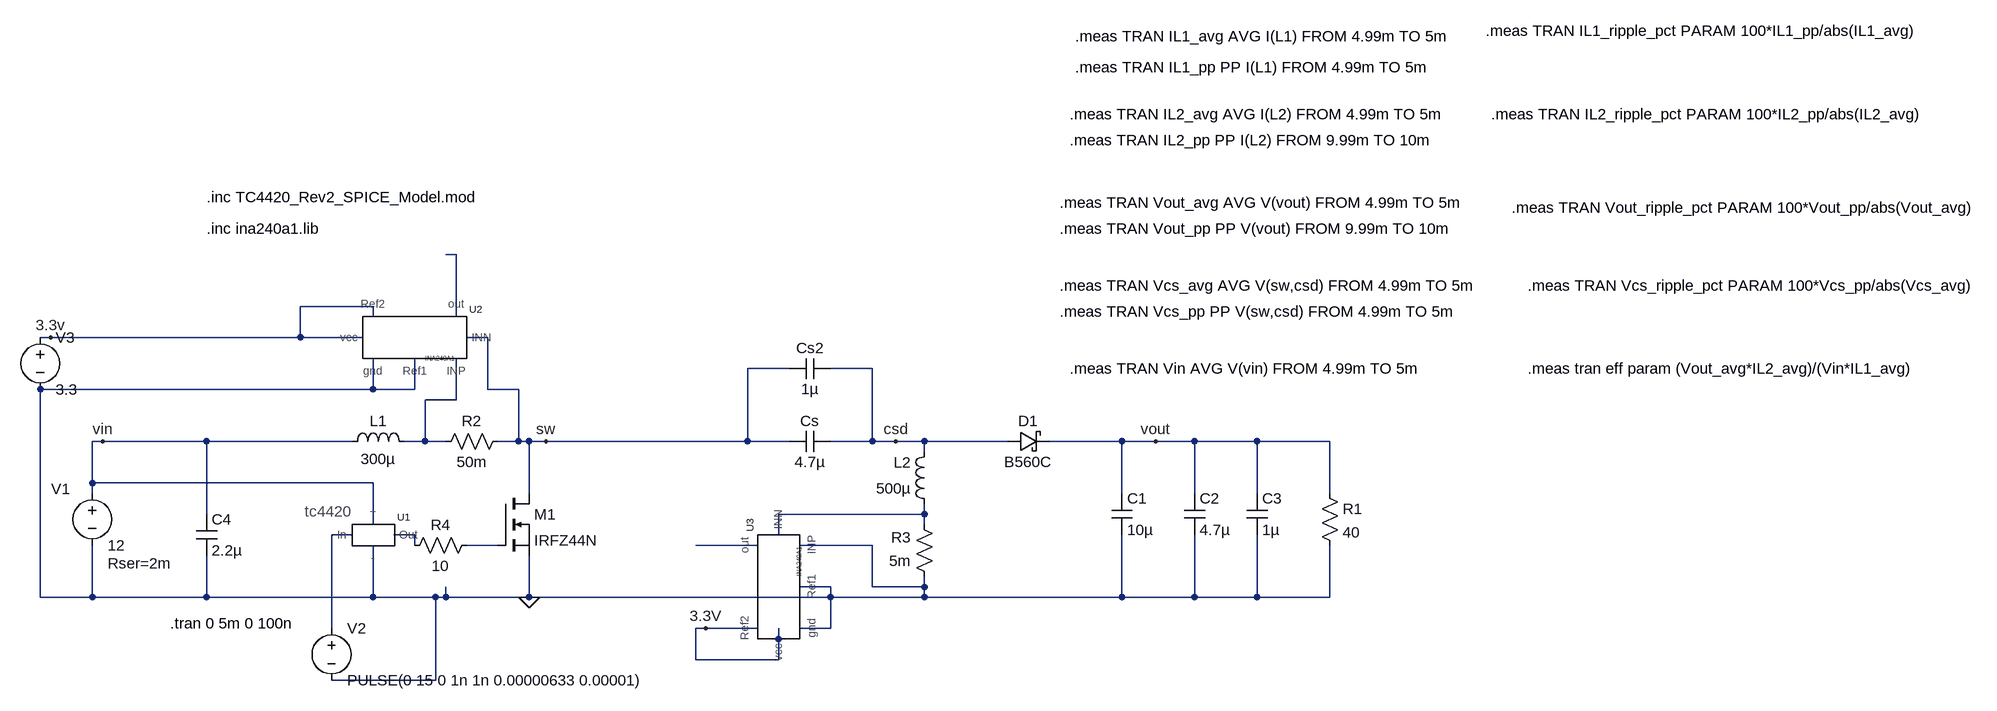
[diagram p0: schematic sepic.asc]
sepic.asc, the LTspice schematic file:
Version 4.1
SHEET 1 2604 680
WIRE 112 -272 96 -272
WIRE -16 -192 -128 -192
WIRE -16 -176 -16 -192
WIRE 112 -176 112 -272
WIRE -512 -144 -528 -144
WIRE -128 -144 -128 -192
WIRE -128 -144 -512 -144
WIRE -32 -144 -128 -144
WIRE 160 -144 128 -144
WIRE 624 -96 560 -96
WIRE 752 -96 688 -96
WIRE -16 -64 -16 -112
WIRE -16 -64 -528 -64
WIRE 48 -64 48 -112
WIRE 48 -64 -16 -64
WIRE 160 -64 160 -144
WIRE 208 -64 160 -64
WIRE 112 -48 112 -112
WIRE 112 -48 64 -48
WIRE -432 16 -448 16
WIRE -272 16 -432 16
WIRE -48 16 -272 16
WIRE 64 16 64 -48
WIRE 64 16 32 16
WIRE 96 16 64 16
WIRE 208 16 208 -64
WIRE 208 16 176 16
WIRE 224 16 208 16
WIRE 250 16 224 16
WIRE 560 16 560 -96
WIRE 560 16 250 16
WIRE 624 16 560 16
WIRE 752 16 752 -96
WIRE 752 16 688 16
WIRE 788 16 752 16
WIRE 832 16 788 16
WIRE 960 16 832 16
WIRE 1136 16 1024 16
WIRE 1188 16 1136 16
WIRE 1248 16 1188 16
WIRE 1344 16 1248 16
WIRE 1456 16 1344 16
WIRE 832 32 832 16
WIRE -448 80 -448 16
WIRE -16 80 -448 80
WIRE -448 96 -448 80
WIRE 224 96 224 16
WIRE 1136 96 1136 16
WIRE 1248 96 1248 16
WIRE 1344 96 1344 16
WIRE 1456 96 1456 16
WIRE -272 128 -272 16
WIRE 832 128 832 112
WIRE 832 128 608 128
WIRE -16 144 -16 80
WIRE 832 144 832 128
WIRE -48 160 -80 160
WIRE 48 160 16 160
WIRE 608 160 608 128
WIRE 48 176 48 160
WIRE 176 176 128 176
WIRE 576 176 480 176
WIRE 752 176 640 176
WIRE 688 240 640 240
WIRE 752 240 752 176
WIRE 832 240 832 224
WIRE 832 240 752 240
WIRE -528 256 -528 -64
WIRE -448 256 -448 176
WIRE -448 256 -528 256
WIRE -272 256 -272 192
WIRE -272 256 -448 256
WIRE -16 256 -16 176
WIRE -16 256 -272 256
WIRE 80 256 -16 256
WIRE 96 256 96 240
WIRE 96 256 80 256
WIRE 224 256 224 192
WIRE 224 256 96 256
WIRE 688 256 688 240
WIRE 688 256 224 256
WIRE 832 256 832 240
WIRE 832 256 688 256
WIRE 1136 256 1136 160
WIRE 1136 256 832 256
WIRE 1248 256 1248 160
WIRE 1248 256 1136 256
WIRE 1344 256 1344 160
WIRE 1344 256 1248 256
WIRE 1456 256 1456 176
WIRE 1456 256 1344 256
WIRE -80 304 -80 160
WIRE 496 304 480 304
WIRE 576 304 496 304
WIRE 688 304 688 256
WIRE 688 304 640 304
WIRE 608 320 608 304
WIRE 480 352 480 304
WIRE 608 352 608 320
WIRE 608 352 480 352
WIRE 80 384 80 256
WIRE 80 384 -80 384
FLAG 224 256 0
FLAG 1188 16 vout
FLAG 250 16 sw
FLAG 788 16 csd
FLAG -432 16 vin
FLAG -512 -144 3.3v
FLAG 496 304 3.3V
SYMBOL voltage -448 80 R0
WINDOW 123 0 0 Left 0
WINDOW 39 24 124 Left 2
WINDOW 0 -63 9 Left 2
SYMATTR SpiceLine Rser=2m
SYMATTR InstName V1
SYMATTR Value 12
SYMBOL ind -64 32 R270
WINDOW 0 32 56 VTop 2
WINDOW 3 5 56 VBottom 2
SYMATTR InstName L1
SYMATTR Value 300µ
SYMATTR SpiceLine Rser=165m
SYMBOL ind 848 128 R180
WINDOW 0 36 80 Left 2
WINDOW 3 36 40 Left 2
SYMATTR InstName L2
SYMATTR Value 500µ
SYMATTR SpiceLine Rser=340m
SYMBOL cap 624 32 R270
WINDOW 0 32 32 VTop 2
WINDOW 3 0 32 VBottom 2
SYMATTR InstName Cs
SYMATTR Value 4.7µ
SYMBOL res 1440 80 R0
SYMATTR InstName R1
SYMATTR Value 40
SYMBOL nmos 176 96 R0
SYMATTR InstName M1
SYMATTR Value IRFZ44N
SYMBOL cap 1120 96 R0
SYMATTR InstName C1
SYMATTR Value 10µ
SYMBOL cap 1232 96 R0
SYMATTR InstName C2
SYMATTR Value 4.7µ
SYMBOL cap 1328 96 R0
SYMATTR InstName C3
SYMATTR Value 1µ
SYMBOL cap 688 -112 R90
WINDOW 0 0 32 VBottom 2
WINDOW 3 32 32 VTop 2
SYMATTR InstName Cs2
SYMATTR Value 1µ
SYMBOL schottky 960 32 R270
WINDOW 0 32 32 VTop 2
WINDOW 3 0 32 VBottom 2
SYMATTR InstName D1
SYMATTR Value B560C
SYMBOL voltage -80 288 R0
WINDOW 123 0 0 Left 0
WINDOW 39 0 0 Left 0
SYMATTR InstName V2
SYMATTR Value PULSE(0 15 0 1n 1n 0.00000633 0.00001)
SYMBOL tc4420 -16 160 R0
SYMATTR InstName U1
SYMBOL ina3 64 -112 R0
WINDOW 3 0 0 Left 0
SYMATTR Value INA240A1
SYMATTR InstName U2
SYMBOL res 80 32 R270
WINDOW 0 32 56 VTop 2
WINDOW 3 0 56 VBottom 2
SYMATTR InstName R2
SYMATTR Value 50m
SYMBOL res 848 240 R180
WINDOW 0 36 76 Left 2
WINDOW 3 36 40 Left 2
SYMATTR InstName R3
SYMATTR Value 5m
SYMBOL voltage -528 -160 R0
WINDOW 123 0 0 Left 0
WINDOW 39 0 0 Left 0
SYMATTR InstName V3
SYMATTR Value 3.3
SYMBOL ina3 640 224 R270
WINDOW 3 0 0 Left 0
SYMATTR Value INA240A1
SYMATTR InstName U3
SYMBOL res 144 160 R90
WINDOW 0 0 56 VBottom 2
WINDOW 3 32 56 VTop 2
SYMATTR InstName R4
SYMATTR Value 10
SYMBOL cap -288 128 R0
SYMATTR InstName C4
SYMATTR Value 2.2µ
TEXT -328 296 Left 2 !.tran 0 5m 0 100n
TEXT -272 -360 Left 2 !.inc TC4420_Rev2_SPICE_Model.mod
TEXT 1064 -608 Left 2 !.meas TRAN IL1_avg AVG I(L1) FROM 4.99m TO 5m
TEXT 1064 -560 Left 2 !.meas TRAN IL1_pp PP I(L1) FROM 4.99m TO 5m
TEXT 1696 -616 Left 2 !.meas TRAN IL1_ripple_pct PARAM 100*IL1_pp/abs(IL1_avg)
TEXT 1056 -488 Left 2 !.meas TRAN IL2_avg AVG I(L2) FROM 4.99m TO 5m
TEXT 1056 -448 Left 2 !.meas TRAN IL2_pp PP I(L2) FROM 9.99m TO 10m
TEXT 1704 -488 Left 2 !.meas TRAN IL2_ripple_pct PARAM 100*IL2_pp/abs(IL2_avg)
TEXT 1040 -352 Left 2 !.meas TRAN Vout_avg AVG V(vout) FROM 4.99m TO 5m
TEXT 1040 -312 Left 2 !.meas TRAN Vout_pp PP V(vout) FROM 9.99m TO 10m
TEXT 1736 -344 Left 2 !.meas TRAN Vout_ripple_pct PARAM 100*Vout_pp/abs(Vout_avg)
TEXT 1040 -224 Left 2 !.meas TRAN Vcs_avg AVG V(sw,csd) FROM 4.99m TO 5m
TEXT 1040 -184 Left 2 !.meas TRAN Vcs_pp PP V(sw,csd) FROM 4.99m TO 5m
TEXT 1760 -224 Left 2 !.meas TRAN Vcs_ripple_pct PARAM 100*Vcs_pp/abs(Vcs_avg)
TEXT -272 -312 Left 2 !.inc ina240a1.lib
TEXT 1056 -96 Left 2 !.meas TRAN Vin AVG V(vin) FROM 4.99m TO 5m
TEXT 1760 -96 Left 2 !.meas tran eff param (Vout_avg*IL2_avg)/(Vin*IL1_avg)

The netlist it stands for:
* sepic.asc
V1 vin 0 12 Rser=2m
L1 vin N002 300µ Rser=165m
L2 N003 csd 500µ Rser=340m
Cs sw csd 4.7µ
R1 vout 0 40
M1 sw N006 0 0 IRFZ44N
C1 vout 0 10µ
C2 vout 0 4.7µ
C3 vout 0 1µ
Cs2 csd sw 1µ
D1 csd vout B560C
V2 N004 0 PULSE(0 15 0 1n 1n 0.00000633 0.00001)
X§U1 N004 N005 vin 0 TC4420_I2D_B  ; pins In Out + -
X§U2 N001 N002 sw 0 3.3v 3.3v 0 INA240A1  ; pins out INP INN Ref1 Ref2 vcc gnd
R2 N002 sw 50m
R3 0 N003 5m
V3 3.3v 0 3.3
X§U3 N007 0 N003 0 3.3v 3.3v 0 INA240A1  ; pins out INP INN Ref1 Ref2 vcc gnd
R4 N006 N005 10
C4 vin 0 2.2µ
.model D D
.lib standard.dio
.model NMOS NMOS
.model PMOS PMOS
.lib standard.mos
.tran 0 5m 0 100n
.inc TC4420_Rev2_SPICE_Model.mod
.meas TRAN IL1_avg AVG I(L1) FROM 4.99m TO 5m
.meas TRAN IL1_pp PP I(L1) FROM 4.99m TO 5m
.meas TRAN IL1_ripple_pct PARAM 100*IL1_pp/abs(IL1_avg)
.meas TRAN IL2_avg AVG I(L2) FROM 4.99m TO 5m
.meas TRAN IL2_pp PP I(L2) FROM 9.99m TO 10m
.meas TRAN IL2_ripple_pct PARAM 100*IL2_pp/abs(IL2_avg)
.meas TRAN Vout_avg AVG V(vout) FROM 4.99m TO 5m
.meas TRAN Vout_pp PP V(vout) FROM 9.99m TO 10m
.meas TRAN Vout_ripple_pct PARAM 100*Vout_pp/abs(Vout_avg)
.meas TRAN Vcs_avg AVG V(sw,csd) FROM 4.99m TO 5m
.meas TRAN Vcs_pp PP V(sw,csd) FROM 4.99m TO 5m
.meas TRAN Vcs_ripple_pct PARAM 100*Vcs_pp/abs(Vcs_avg)
.inc ina240a1.lib
.meas TRAN Vin AVG V(vin) FROM 4.99m TO 5m
.meas tran eff param (Vout_avg*IL2_avg)/(Vin*IL1_avg)
.backanno
.end